# Altium schematic sheet rf_smps.SchDoc: mcHF Pro Transceiver RF board
size A3; Author: Krassi Atanassov; CompanyName: MØNKA; Engineer: For radio amateurs experimentation, non-commercial use only. Thank you!; Revision: 0.8.5; SheetTotal: 14
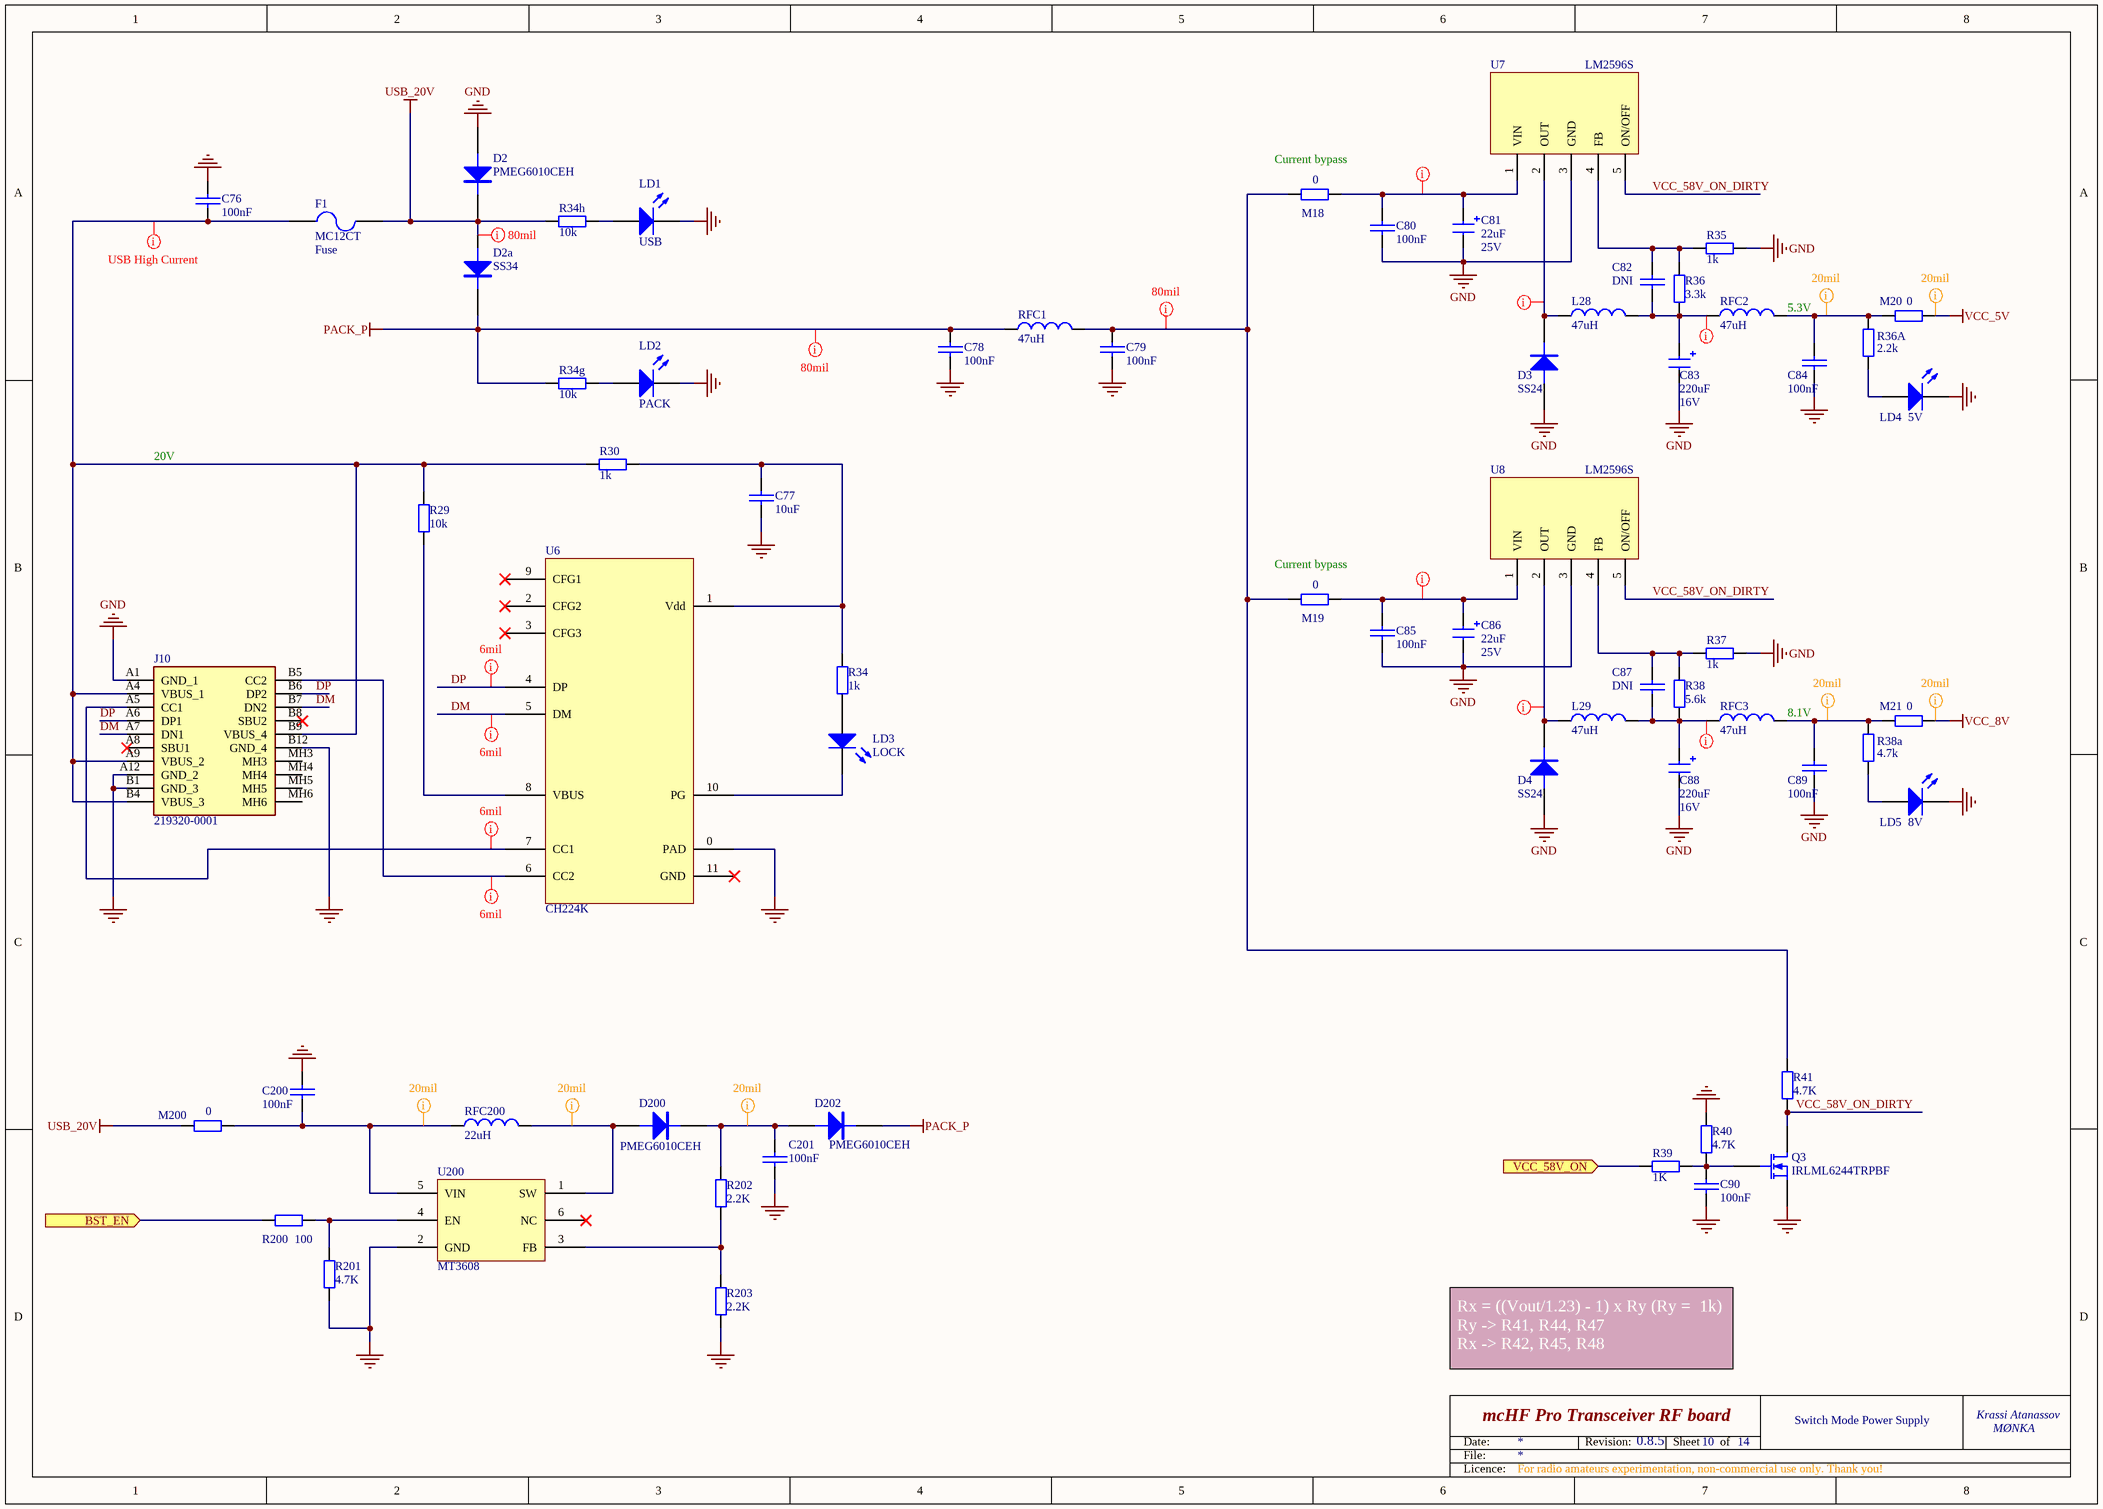
[diagram p0: rf_smps.SchDoc]

## Parts
C76  100nF  [0805]
C77  10uF  [0805]
C78  100nF  [0805]
C79  100nF  [0805]
C80  100nF  [0805]
C81  22uF  Voltage: 25V  [1206_Elec_Cap]
C82  DNI  [0805]  (no BOM)
C83  220uF  Voltage: 16V  [CAP_ALUM_Pro]
C84  100nF  [0805]
C85  100nF  [0805]
C86  22uF  Voltage: 25V  [1206_Elec_Cap]
C87  DNI  [0805]  (no BOM)
C88  220uF  Voltage: 16V  [CAP_ALUM_Pro]
C89  100nF  [0805]
C90  100nF  [0805]
C200  100nF  [0805]
C201  100nF  [0805]
D2  PMEG6010CEH  [SOD87]
D2a  SS34  [DO214]
D3  SS24  [DO214]
D4  SS24  [DO214]
D200  PMEG6010CEH  [SOD87]
D202  PMEG6010CEH  [SOD87]
F1  MC12CT  [1206]
J10  219320-0001  [MOLX_USB]
L28  47uH  [CD75]
L29  47uH  [CD75]
LD1  USB  [1206_Elec_Cap]  (no BOM)
LD2  PACK  [1206_Elec_Cap]  (no BOM)
LD3  LOCK  [1206_Elec_Cap]  (no BOM)
LD4  5V  [1206_Elec_Cap]  (no BOM)
LD5  8V  [1206_Elec_Cap]  (no BOM)
M18  0  [0805]
M19  0  [0805]
M20  0  [0805]
M21  0  [0805]
M200  0  [0805]
Q3  IRLML6244TRPBF  [SOT-23-Pro]
R29  10k  [0805]
R30  1k  [0805]
R34  1k  [0805]
R34g  10k  [0805]
R34h  10k  [0805]
R35  1k  [0805]
R36  3.3k  [0805]
R36A  2.2k  [0805]
R37  1k  [0805]
R38  5.6k  [0805]
R38a  4.7k  [0805]
R39  1K  [0805]
R40  4.7K  [0805]
R41  4.7K  [0805]
R200  100  [0805]
R201  4.7K  [0805]
R202  2.2K  [0805]
R203  2.2K  [0805]
RFC1  47uH  [BIG_IND]
RFC2  47uH  [CD75]
RFC3  47uH  [CD75]
RFC200  22uH  [0805]
U6  CH224K  [ch224k]
U7  LM2596S  [TO-263-5]
U8  LM2596S  [TO-263-5]
U200  MT3608  [SOT25-6]

## Ports
BST_EN (in), VCC_58V_ON (in)

## Nets
GND: C76.1 C77.2 C78.1 C79.1 C80.2 C81.2 C83.2 C84.2 C85.2 C86.2 C88.2 C89.2 C90.2 C200.1 C201.2 D2.1(A) D3.1(A) D4.1(A) J10.A1(GND_1) J10.A12(GND_2) J10.B1(GND_3) J10.B12(GND_4) LD1.2(K) LD2.2(K) LD4.2(K) LD5.2(K) Q3.2(S) R35.2 R37.2 R40.2 R201.1 R203.2 U6.0(PAD) U7.3(GND) U8.3(GND) U200.2(GND)
PACK_P: C78.2 D2a.2(K) D202.2(K) R34g.2 RFC1.1
USB_20V: D2.2(K) D2a.1(A) F1.1 M200.2 R34h.2
VCC_5V: M20.1
VCC_8V: M21.1
BST_EN: R200.1 ; port BST_EN
DM: J10.A7(DN1) J10.B7(DN2) U6.5(DM)
DP: J10.A6(DP1) J10.B6(DP2) U6.4(DP)
VCC_58V_ON: R39.1 ; port VCC_58V_ON
VCC_58V_ON_DIRTY: Q3.3(D) R41.1 U7.5(ON/OFF) U8.5(ON/OFF)
NetC76_2: C76.2 F1.2 J10.A4(VBUS_1) J10.A9(VBUS_2) J10.B4(VBUS_3) J10.B9(VBUS_4) R29.2 R30.1
NetC77_1: C77.1 R30.2 R34.2 U6.1(Vdd)
NetC79_2: C79.2 M18.2 M19.2 R41.2 RFC1.2
NetC80_1: C80.1 C81.1 M18.1 U7.1(VIN)
NetC82_1: C82.1 R35.1 R36.2 U7.4(FB)
NetC82_2: C82.2 C83.1 L28.2 R36.1 RFC2.1
NetC84_1: C84.1 M20.2 R36A.2 RFC2.2
NetC85_1: C85.1 C86.1 M19.1 U8.1(VIN)
NetC87_1: C87.1 R37.1 R38.2 U8.4(FB)
NetC87_2: C87.2 C88.1 L29.2 R38.1 RFC3.1
NetC89_1: C89.1 M21.2 R38a.2 RFC3.2
NetC90_1: C90.1 Q3.1(G) R39.2 R40.1
NetC200_2: C200.2 M200.1 RFC200.1 U200.5(VIN)
NetC201_1: C201.1 D200.2(K) D202.1(A) R202.1
NetD3_2: D3.2(K) L28.1 U7.2(OUT)
NetD4_2: D4.2(K) L29.1 U8.2(OUT)
NetD200_1: D200.1(A) RFC200.2 U200.1(SW)
NetJ10_A5: J10.A5(CC1) U6.7(CC1)
NetJ10_B5: J10.B5(CC2) U6.6(CC2)
NetLD1_1: LD1.1(A) R34h.1
NetLD2_1: LD2.1(A) R34g.1
NetLD3_1: LD3.1(A) R34.1
NetLD3_2: LD3.2(K) U6.10(PG)
NetLD4_1: LD4.1(A) R36A.1
NetLD5_1: LD5.1(A) R38a.1
NetR29_1: R29.1 U6.8(VBUS)
NetR200_2: R200.2 R201.2 U200.4(EN)
NetR202_2: R202.2 R203.1 U200.3(FB)

Not connected (* = marked no-connect by the designer): J10 A8(SBU1)* B8(SBU2)* MH3 MH4 MH5 MH6; U6 2(CFG2)* 3(CFG3)* 9(CFG1)* 11(GND)*; U200 6(NC)*

## Layout directives
rule Width Constraint [Pref Width = 20mil    Min Width = 20mil    Max Width = 20mil]: NetC84_1, NetC89_1, NetC200_2, NetC201_1, NetD200_1, VCC_5V, VCC_8V
rule Width Constraint [Pref Width = 30mil    Min Width = 30mil    Max Width = 30mil]: NetC80_1, NetC82_2, NetC85_1, NetC87_2, NetD3_2, NetD4_2
rule Width Constraint [Pref Width = 80mil    Min Width = 80mil    Max Width = 80mil]: NetC79_2, PACK_P, USB_20V
rule Width Constraint [Pref Width = 24mil    Min Width = 24mil    Max Width = 24mil]: NetC76_2
rule Width Constraint [Pref Width = 6mil    Min Width = 6mil    Max Width = 6mil]: DM, DP, NetJ10_A5, NetJ10_B5

## Notes on the sheet
- (near M18) Current bypass
- (near RFC2) 5.3V
- 20V
- (near M19) Current bypass
- (near RFC3) 8.1V
- Rx = ((Vout/1.23) - 1) x Ry (Ry =  1k)
  Ry -> R41, R44, R47
  Rx -> R42, R45, R48
- 10
- Switch Mode Power Supply
- Date:
- File:
- Revision:
- Sheet
- of
- Licence:

## Library data of the parts
C76 C77 = CAP: Capacitor; QT Order: QCC-00154; Price: 0.068
C78-C80 C82 C84 C85 C87 C89 C90 = CAP: Capacitor; Voltage: 100V; QT Order: QCC-00154; Price: 0.068
C81 C83 C86 C88 = CAP-POL: Electrolitic capacitor; QT Order: QCC-00202; Price: 0.235
C200 C201 = CAP: Capacitor; Order: FN 282-1264; QT Order: QCC-00157; Price: 0.089
D2 D2a D3 D4 = PMEG6010CEH: DIODE, SCHOTTKY, 1A, 60V, SOD-123F; QT Order: QCD-00034; Price: 0.085
D200 D202 = PMEG6010CEH: DIODE, SCHOTTKY, 1A, 60V, SOD-123F; Order: FN 151-0694; QT Order: QCD-00034; QT Price: 0.08; Price: 0.262
F1 = Fuse: QT Order: QCI-00216; Price: 0.134; Function: Fuse
J10 = 219320-0001: Universal Serial Bus (USB) Shielded I/O Receptacle, Type C, Vertical, Surface Mount, Height 8.8mm, 16 Circuits, Gold (Au) Flash Plating; Manufacturer_Name: Molex; Geometry.Height: 9.05mm; Mouser Part Number: 538-219320-0001; Mouser Price/Stock: https://www.mouser.co.uk/ProductDetail/Molex/219320-0001?qs=rQFj71Wb1eXha8qVBIXu3A%3D%3D; Manufacturer_Part_Number: 219320-0001; Datasheet Link: https://www.molex.com/content/dam/molex/molex-dot-com/products/automated/en-us/salesdrawingpdf/219/219320/2193200001_sd.pdf?inline
L28 L29 RFC1-RFC3 = TDK-NLV25T: POWER INDUCTOR, 47UH, 1210; Price: 0.166; Notes: Power inductor
LD1-LD5 = LED2: LED 3mm; QT Order: QCD-00052; Revision: July-2002: Re-released for DXP Platform.; Price: 0.116
M18-M21 M200 = RES: Resistor; QT Order: QCR-00268; Price: 0.009
Q3 = MOSFET-N: N-Channel MOSFET; QT Order: QCT-00022; QT Price: 0.28; Price: 0.231
R29 R30 R34 R34g R34h = RES: Resistor; Notes: Tolerance better than 1%; Price: 0.009
R35 R36A R37 R38a R41 = RES: Resistor; QT Order: QCR-00341; Price: 0.024
R36 = RES: Resistor; Order: 71-CRCW08053K30FKEAC; QT Order: QCR-00341; Price: 0.024
R38 = RES: Resistor; Order: 667-ERJ-6GEYJ562V; QT Order: QCR-00341; Price: 0.024
R39 R40 = RES: Resistor
R200 = RES: Resistor; Order: FN 157-6459; QT Order: QCR-00326; Price: 0.061
R201 = RES: Resistor; Order: FN 200-8383; QT Order: QCR-00341; Price: 0.03
R202 R203 = RES: Resistor; Order: FN 188-7289; QT Order: QCR-00333; QT Price: 0.03; Price: 0.075
RFC200 = Inductor: Power Inductor; QT Order: QCL-00097; QT Price: 0.085; Price: 0
U6 = CH224K: USB-PD trigger chip; Order: DK 336-2518-ND; Price: 8.72
U7 U8 = LM2596S: V REG ADJ +5/20V, SMPS TO-263-5; Notes: In bulk from Ali; Price: 1.28
U200 = MT3608: Charge Pump; Order: Hotmcu.com; QT Order: QCI-01775; QT Price: 0.27; Notes: Originally from Thomas, if not Ali; Price: 0.5